# EAGLE design ATMega168-CAN (EAGLE 7.2.0)
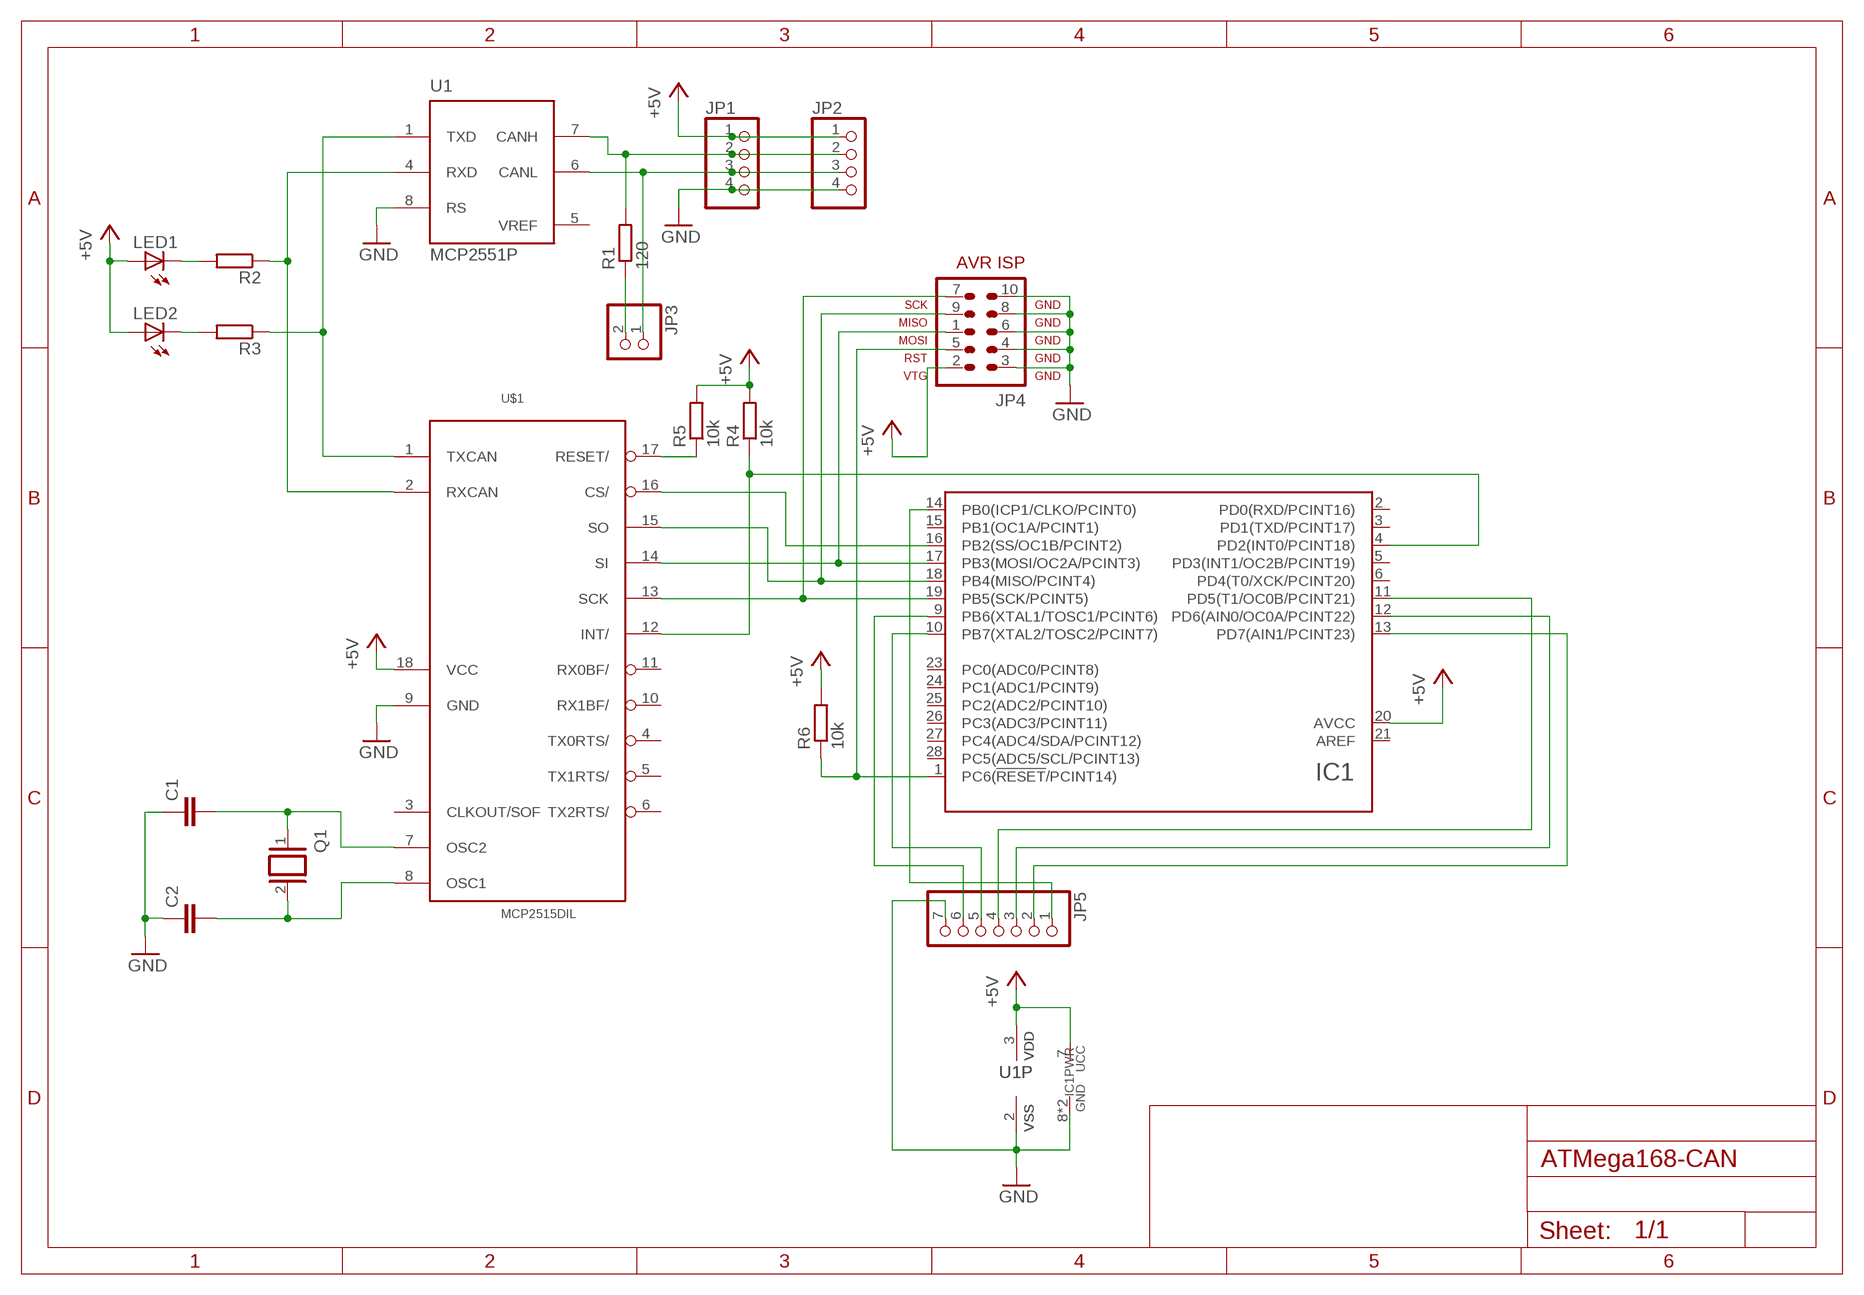
[diagram p0: schematic, sheet 1]

## Parts
C1  C-EU025-024X044  [C025-024X044]
C2  C-EU025-024X044  [C025-024X044]
IC1  ATMEGA48/88/168/328-PU(DIP28)PU  [DIL28]
JP1  PINHD-1X4/90  [1X04/90]
JP2  PINHD-1X4/90  [1X04/90]
JP3  PINHD-1X2  [1X02]
JP4  AVR-ISP-10  [AVR-ISP-10]
JP5  PINHD-1X7  [1X07]
LED1  LED5MM  [LED5MM]
LED2  LED5MM  [LED5MM]
Q1  XTAL/S  [QS]
R1  120  R-EU_0207/10  [0207/10]
R2  R-EU_0207/10  [0207/10]
R3  R-EU_0207/10  [0207/10]
R4  10k  R-EU_0207/10  [0207/10]
R5  10k  R-EU_0207/10  [0207/10]
R6  10k  R-EU_0207/10  [0207/10]
U1  MCP2551P  [DIL8]
U$1  MCP2515DIL  [DIL18]

## Nets
+5V: IC1.7(UCC) IC1.20(AVCC) JP1.1 JP2.1 JP4.2 LED1.A LED2.A R4.2 R5.2 R6.2 U1.3(VDD) U$1.18(VCC)
GND: C1.1 C2.1 IC1.8(GND) IC1.22(GND) JP1.4 JP2.4 JP4.3 JP4.4 JP4.6 JP4.8 JP4.10 JP5.7 U1.2(VSS) U1.8(RS) U$1.9(GND)
N$1: C2.2 Q1.2 U$1.8(OSC1)
N$2: C1.2 Q1.1 U$1.7(OSC2)
N$3: JP1.2 JP2.2 R1.2 U1.7(CANH)
N$4: JP1.3 JP2.3 JP3.1 U1.6(CANL)
N$5: IC1.4(PD2(INT0/PCINT18)) R4.1 U$1.12(INT/)
N$6: IC1.19(PB5(SCK/PCINT5)) JP4.7 U$1.13(SCK)
N$7: JP3.2 R1.1
N$8: IC1.17(PB3(MOSI/OC2A/PCINT3)) JP4.1 U$1.14(SI)
N$9: IC1.18(PB4(MISO/PCINT4)) JP4.9 U$1.15(SO)
N$10: IC1.16(PB2(SS/OC1B/PCINT2)) U$1.16(CS/)
N$11: R3.1 U1.1(TXD) U$1.1(TXCAN)
N$12: R2.1 U1.4(RXD) U$1.2(RXCAN)
N$13: LED1.K(C) R2.2
N$14: LED2.K(C) R3.2
N$15: R5.1 U$1.17(RESET/)
N$16: IC1.1(PC6(!RESET!/PCINT14)) JP4.5 R6.1
N$17: IC1.9(PB6(XTAL1/TOSC1/PCINT6)) JP5.6
N$18: IC1.10(PB7(XTAL2/TOSC2/PCINT7)) JP5.5
N$19: IC1.11(PD5(T1/OC0B/PCINT21)) JP5.4
N$20: IC1.12(PD6(AIN0/OC0A/PCINT22)) JP5.3
N$21: IC1.13(PD7(AIN1/PCINT23)) JP5.2
N$22: IC1.14(PB0(ICP1/CLKO/PCINT0)) JP5.1
Unconnected: IC1.2(PD0(RXD/PCINT16)) IC1.3(PD1(TXD/PCINT17)) IC1.5(PD3(INT1/OC2B/PCINT19)) IC1.6(PD4(T0/XCK/PCINT20)) IC1.15(PB1(OC1A/PCINT1)) IC1.21(AREF) IC1.23(PC0(ADC0/PCINT8)) IC1.24(PC1(ADC1/PCINT9)) IC1.25(PC2(ADC2/PCINT10)) IC1.26(PC3(ADC3/PCINT11)) IC1.27(PC4(ADC4/SDA/PCINT12)) IC1.28(PC5(ADC5/SCL/PCINT13)) U$1.3(CLKOUT/SOF) U$1.4(TX0RTS/) U$1.5(TX1RTS/) U$1.6(TX2RTS/) U$1.10(RX1BF/) U$1.11(RX0BF/)

## Power pins joined to a net without a drawn wire
VREF: U1.5(VREF)

## Library data of the parts
C1 C2 = rcl:C-EU: CAPACITOR, European symbol
IC1 = atmel_tiny24-44-84tiny48-88mega48-88-168-328:ATMEGA48/88/168/328-PU(DIP28)
JP1 JP2 = pinhead:PINHD-1X4: PIN HEADER
JP3 = pinhead:PINHD-1X2: PIN HEADER
JP4 = avr-7:AVR-ISP-10: AVR ISP-10 Serial Programming Header
JP5 = pinhead:PINHD-1X7: PIN HEADER
LED1 LED2 = led:LED: LED OSRAM: - CHIPLED LG R971, LG N971, LY N971, LG Q971, LY Q971, LO R971, LY R971 LH N974, LH R974 LS Q976, LO Q976, LY Q976 LO Q996 - Hyper CHIPLED LW Q18S LB Q993, LB Q99A, LB R99A - SideLED LS A670, LO A670, LY A670, LG A670, LP A670 LB A673, LV A673, LT A673, LW A673 LH A674 LY A675 LS A676, LA A676, LO A676, LY A676, LW A676 LS A679, LY A679, LG A679 - Hyper Micro SIDELED® LS Y876, LA Y876, LO Y876, LY Y876 LT Y87S - SmartLED LW L88C, LW L88S LB L89C, LB L89S, LG L890 LS L89K, LO L89K, LY L89K LS L896, LA L896, LO L896, LY L896 - TOPLED LS T670, LO T670, LY T670, LG T670, LP T670 LSG T670, LSP T670, LSY T670, LOP T670, LYG T670 LG T671, LOG T671, LSG T671 LB T673, LV T673, LT T673, LW T673 LH T674 LS T676, LA T676, LO T676, LY T676, LB T676, LH T676, LSB T676, LW T676 LB T67C, LV T67C, LT T67C, LS T67K, LO T67K, LY T67K, LW E67C LS E67B, LA E67B, LO E67B, LY E67B, LB E67C, LV E67C, LT E67C LW T67C LS T679, LY T679, LG T679 LS T770, LO T770, LY T770, LG T770, LP T770 LB T773, LV T773, LT T773, LW T773 LH T774 LS E675, LA E675, LY E675, LS T675 LS T776, LA T776, LO T776, LY T776, LB T776 LHGB T686 LT T68C, LB T68C - Hyper Mini TOPLED® LB M676 - Mini TOPLED Santana® LG M470 LS M47K, LO M47K, LY M47K Source: http://www.osram.convergy.de LUXEON: - LUMILED® LXK2-PW12-R00, LXK2-PW12-S00, LXK2-PW14-U00, LXK2-PW14-V00 LXK2-PM12-R00, LXK2-PM12-S00, LXK2-PM14-U00 LXK2-PE12-Q00, LXK2-PE12-R00, LXK2-PE12-S00, LXK2-PE14-T00, LXK2-PE14-U00 LXK2-PB12-K00, LXK2-PB12-L00, LXK2-PB12-M00, LXK2-PB14-N00, LXK2-PB14-P00, LXK2-PB14-Q00 LXK2-PR12-L00, LXK2-PR12-M00, LXK2-PR14-Q00, LXK2-PR14-R00 LXK2-PD12-Q00, LXK2-PD12-R00, LXK2-PD12-S00 LXK2-PH12-R00, LXK2-PH12-S00 LXK2-PL12-P00, LXK2-PL12-Q00, LXK2-PL12-R00 Source: www.luxeon.com KINGBRIGHT: KA-3528ASYC Source: www.kingbright.com
Q1 = special:XTAL/S: CRYSTAL
R1-R6 = rcl:R-EU_: RESISTOR, European symbol
U1 = microchip_can:MCP2551: High Speed CAN tranceiver
U$1 = MCP2515_MT:MCP2515*: MCP2515 Standalone CAN-Controller by Microchip Eagle-Lib. by MartinThomas

## Board
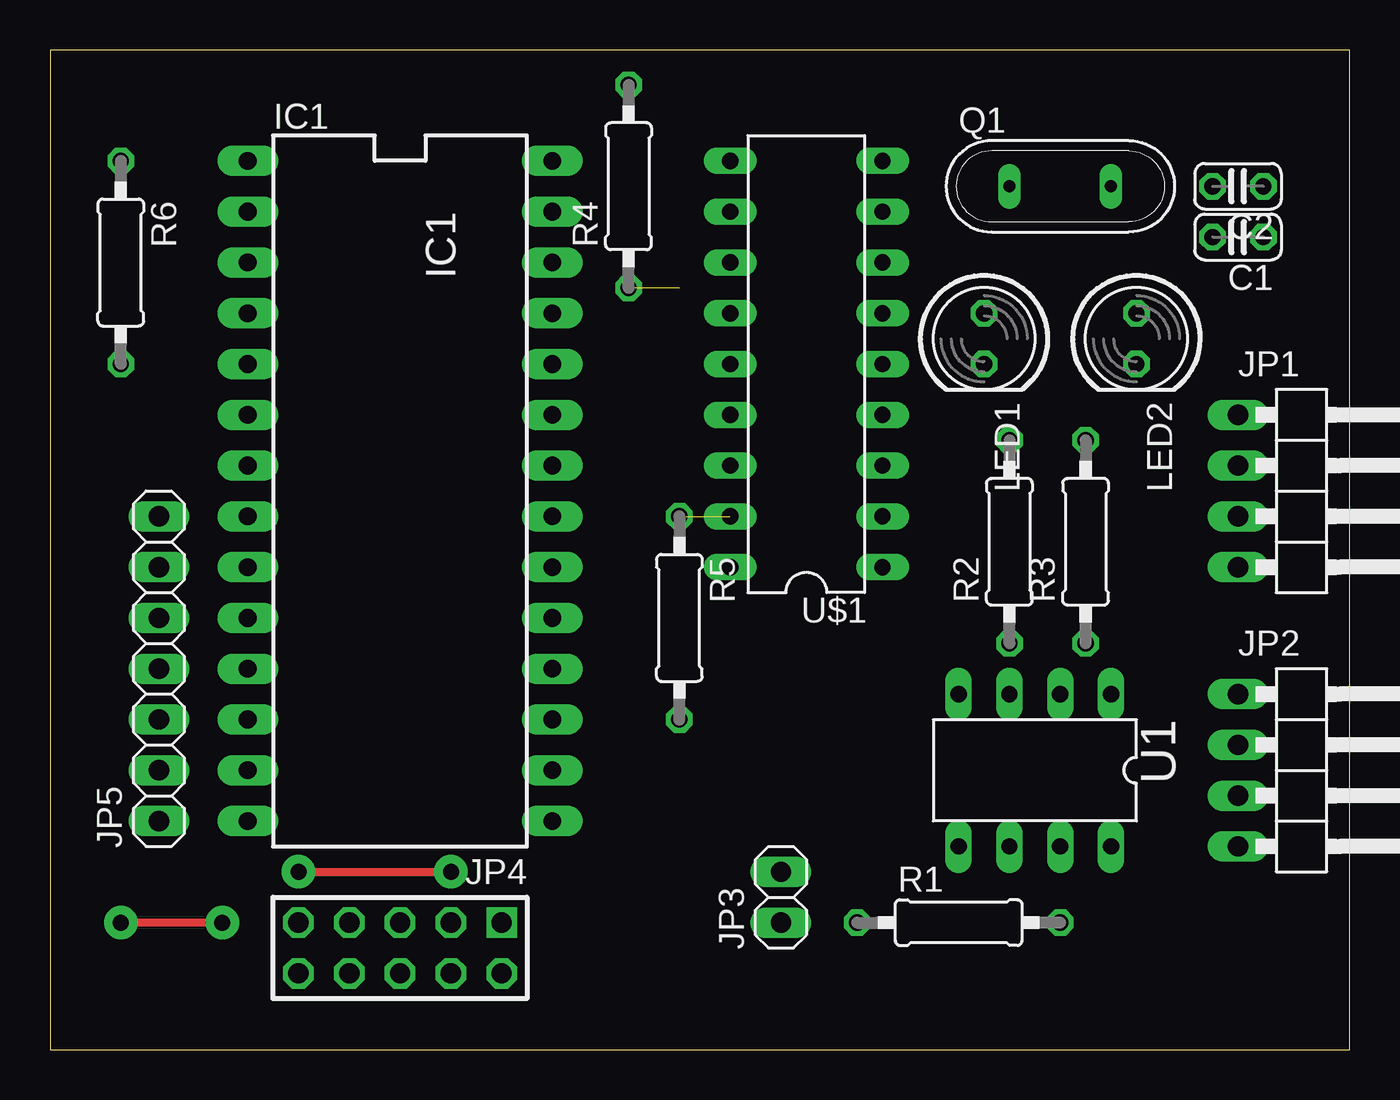
[diagram p1: board, top side]
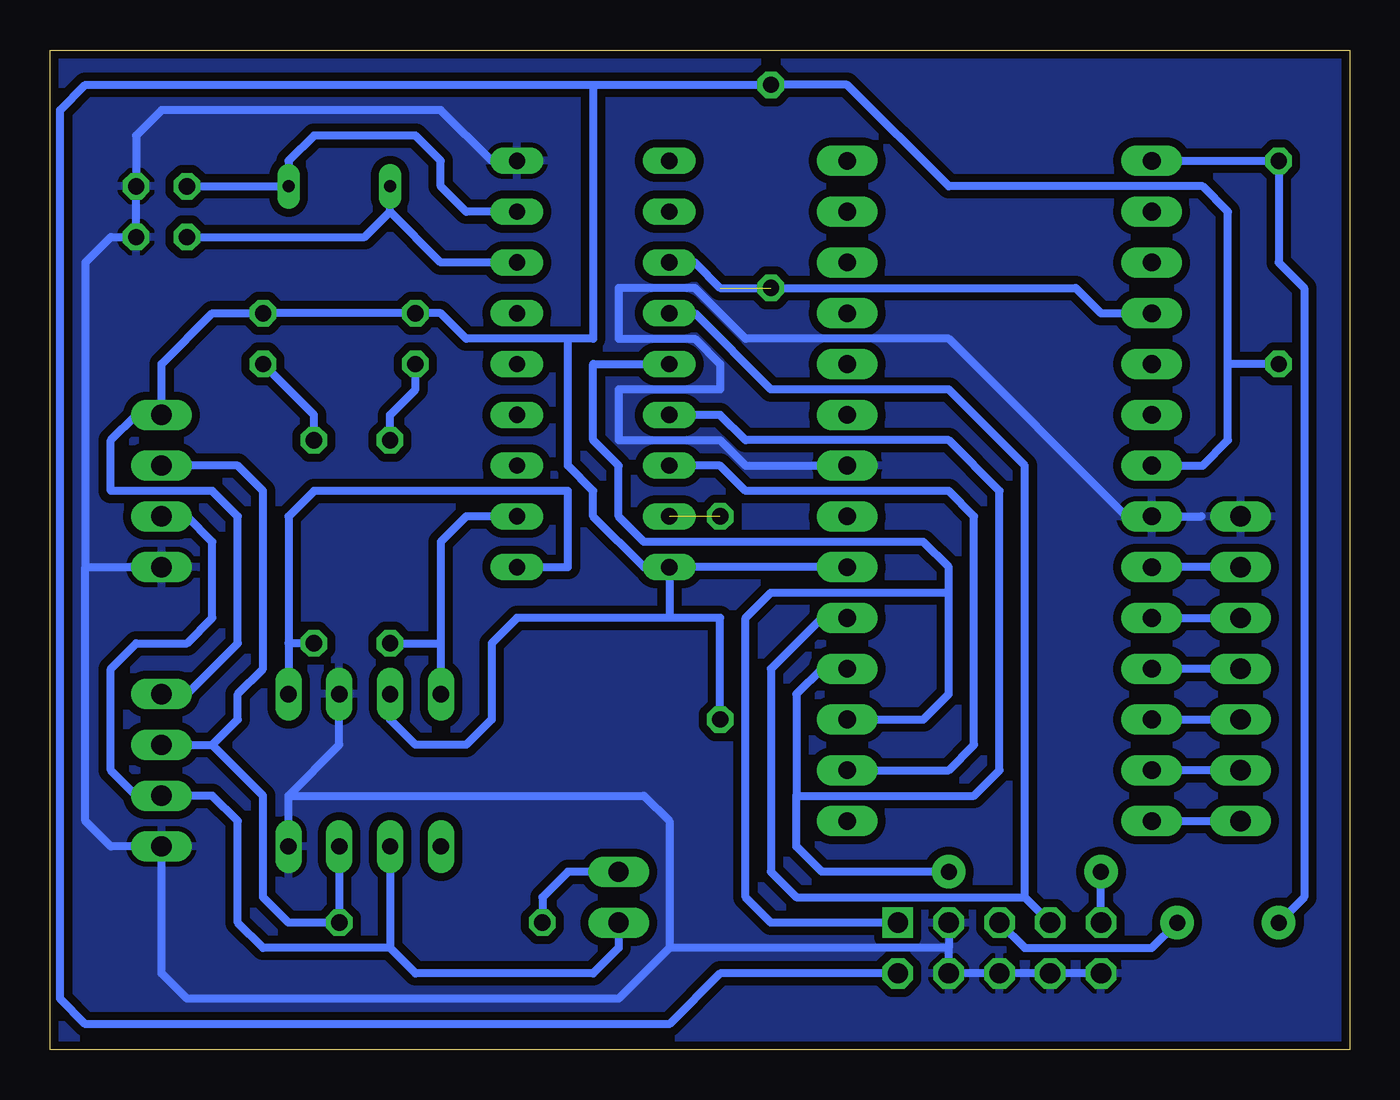
[diagram p2: board, bottom side, seen from below]

Size 65 x 50 mm. Coordinates in mm from the lower left corner, seen from the top.
Outline: 0,0 65,0 65,50 0,50 0,0
Copper layers (1*16): Top 0.035mm / dielectric 1.5mm / Bottom 0.035mm
Design rules "default *": minimum track width 10mil, minimum drill 24mil, track to track 16mil, track to pad 16mil, pad to pad 16mil, via to via 16mil, smd to smd 0mil, copper to edge 16mil, drill to drill 8mil, minimum pad ring 10mil, minimum via ring 8mil, stop-mask expansion 4mil, vias tented up to drill 0mil, thermal gap 10mil

### Footprints (pad centres in the part's own frame; a part is rotated, then mirrored left to right if it is on the bottom)
C025-024X044 = drill 0.813 octagon: 1 -1.27,0; 2 1.27,0
DIL28 = drill 0.889 pad 1.524 long: 1 -16.51,-7.62; 2 -13.97,-7.62; 3 -11.43,-7.62; 4 -8.89,-7.62; 5 -6.35,-7.62; 6 -3.81,-7.62; 7 -1.27,-7.62; 8 1.27,-7.62; 9 3.81,-7.62; 10 6.35,-7.62; 11 8.89,-7.62; 12 11.43,-7.62; 13 13.97,-7.62; 14 16.51,-7.62; 15 16.51,7.62; 16 13.97,7.62; 17 11.43,7.62; 18 8.89,7.62; 19 6.35,7.62; 20 3.81,7.62; 21 1.27,7.62; 22 -1.27,7.62; 23 -3.81,7.62; 24 -6.35,7.62; 25 -8.89,7.62; 26 -11.43,7.62; 27 -13.97,7.62; 28 -16.51,7.62
1X04/90 = drill 1.016 long: 1 -3.81,-3.81; 2 -1.27,-3.81; 3 1.27,-3.81; 4 3.81,-3.81
1X02 = drill 1.016 long: 1 -1.27,0; 2 1.27,0
AVR-ISP-10 = drill 1.016 square: 1 -5.08,-1.27 | drill 1.016 octagon: 2 -5.08,1.27; 3 -2.54,-1.27; 4 -2.54,1.27; 5 0,-1.27; 6 0,1.27; 7 2.54,-1.27; 8 2.54,1.27; 9 5.08,-1.27; 10 5.08,1.27
1X07 = drill 1.016 long: 1 -7.62,0; 2 -5.08,0; 3 -2.54,0; 4 0,0; 5 2.54,0; 6 5.08,0; 7 7.62,0
LED5MM = drill 0.813 octagon: A -1.27,0; K 1.27,0
QS = drill 0.61 long: 1 -2.54,0; 2 2.54,0
0207/10 = drill 0.813 octagon: 1 -5.08,0; 2 5.08,0
DIL8 = drill 0.813 long: 1 -3.81,-3.81; 2 -1.27,-3.81; 3 1.27,-3.81; 4 3.81,-3.81; 5 3.81,3.81; 6 1.27,3.81; 7 -1.27,3.81; 8 -3.81,3.81
DIL18 = drill 0.813 long: 1 -10.16,-3.81; 2 -7.62,-3.81; 3 -5.08,-3.81; 4 -2.54,-3.81; 5 0,-3.81; 6 2.54,-3.81; 7 5.08,-3.81; 8 7.62,-3.81; 9 10.16,-3.81; 10 10.16,3.81; 11 7.62,3.81; 12 5.08,3.81; 13 2.54,3.81; 14 0,3.81; 15 -2.54,3.81; 16 -5.08,3.81; 17 -7.62,3.81; 18 -10.16,3.81

### Placement (x,y rotation side)
C1  59.42,40.64 180 top
C2  59.42,43.18 180 top
IC1  17.51,27.94 270 top
JP1  63.23,27.94 270 top
JP2  63.23,13.97 270 top
JP3  36.56,7.62 90 top
JP4  17.51,5.08 180 top
JP5  5.45,19.05 90 top
LED1  46.72,35.56 270 top
LED2  54.34,35.56 270 top
Q1  50.53,43.18 0 top
R1  45.45,6.35 0 top
R2  47.99,25.4 90 top
R3  51.8,25.4 90 top
R4  28.94,43.18 90 top
R5  31.48,21.59 270 top
R6  3.54,39.37 270 top
U1  49.26,13.97 180 top
U$1  37.83,34.29 90 top

### Tracks (layer width: path | path; a pad name or v marks a point on that pad's centre or on a via)
+5V
  Bottom 0.406: JP2.1 58.15,17.78 55.61,20.32 55.61,26.67 56.88,27.94 61.96,27.94 61.96,30.48 60.69,31.75 JP1.1 59.42,34.29 56.88,36.83 LED2.A LED1.A 45.45,36.83 44.18,35.56 39.1,35.56 | U$1.18 35.29,24.13 37.83,26.67 37.83,27.94 39.1,29.21 39.1,35.56 | 39.1,35.56 37.83,35.56 37.83,48.26 | U$1.18 34.02,21.59 | 34.02,21.59 41.64,21.59 42.91,20.32 42.91,16.51 44.18,15.24 46.72,15.24 47.99,16.51 U1.3 | IC1.20 U$1.18 | JP4.2 31.48,3.81 34.02,1.27 63.23,1.27 64.5,2.54 64.5,46.99 63.23,48.26 37.83,48.26 | 37.83,48.26 R4.2 25.13,48.26 20.05,43.18 7.35,43.18 6.08,41.91 6.08,34.29 | R5.2 31.48,21.59 34.02,21.59 | IC1.7 7.35,29.21 6.08,30.48 6.08,34.29 | R6.2 6.08,34.29
GND
  Bottom 0.406: 53.07,12.7 50.53,15.24 U1.2 | 63.23,24.13 63.23,11.43 61.96,10.16 JP2.4 59.42,3.81 58.15,2.54 36.56,2.54 34.02,5.08 | 63.23,24.13 JP1.4 | 63.23,24.13 63.23,39.37 61.96,40.64 C1.1 C2.1 60.69,45.72 59.42,46.99 45.45,46.99 42.91,44.45 U$1.9 | JP4.10 JP4.8 JP4.6 JP4.4 20.05,5.08 | JP4.3 20.05,5.08 | 20.05,5.08 34.02,5.08 | U1.8 53.07,12.7 | 53.07,12.7 35.29,12.7 34.02,11.43 34.02,5.08 | IC1.22 30.21,29.21 31.48,30.48 36.56,30.48 36.56,33.02 31.48,33.02 31.48,34.29 32.75,35.56 36.56,35.56 36.56,38.1 32.75,38.1 30.21,35.56 20.05,35.56 11.16,26.67 IC1.8 7.4,26.67
  pour Bottom: 0,50 0,0 65,0 65,50
N$1
  Bottom 0.406: U$1.8 44.18,41.91 45.45,43.18 45.45,44.45 46.72,45.72 51.8,45.72 53.07,44.45 Q1.2 C2.2
N$2
  Bottom 0.406: U$1.7 45.45,39.37 47.99,41.91 | 47.99,41.91 Q1.1 | C1.2 49.26,40.64 47.99,41.91
N$3
  Bottom 0.406: U1.7 R1.2 53.07,6.35 54.34,7.62 54.34,12.7 56.88,15.24 | JP2.2 56.88,15.24 | 56.88,15.24 55.61,16.51 55.61,17.78 54.34,19.05 54.34,27.94 55.61,29.21 JP1.2
N$4
  Bottom 0.406: JP1.3 58.15,26.67 56.88,25.4 56.88,21.59 58.15,20.32 60.69,20.32 61.96,19.05 61.96,13.97 60.69,12.7 JP2.3 56.88,12.7 55.61,11.43 55.61,6.35 54.34,5.08 47.99,5.08 | U1.6 47.99,5.08 | JP3.1 36.56,5.08 37.83,3.81 46.72,3.81 47.99,5.08
N$5  (1 unrouted)
  Bottom 0.406: U$1.12 32.75,39.37 31.48,38.1 13.7,38.1 12.43,36.83 IC1.4
N$6
  Bottom 0.406: IC1.19 26.4,21.59 28.94,19.05 28.94,8.89 27.67,7.62 16.24,7.62 | 16.24,7.62 16.24,29.21 20.05,33.02 28.94,33.02 32.75,36.83 U$1.13 | JP4.7 16.24,7.62
N$7
  Bottom 0.406: JP3.2 39.1,8.89 40.37,7.62 R1.1
N$8
  Bottom 0.406: IC1.17 21.32,16.51 20.05,17.78 20.05,22.86 | 20.05,22.86 20.05,24.13 21.32,25.4 35.29,25.4 36.56,26.67 36.56,29.21 37.83,30.48 37.83,34.29 U$1.14 | 20.05,22.86 28.94,22.86 30.21,21.59 30.21,7.62 28.94,6.35 JP4.1
N$9  (via drill 0.8 pad 1.68)
  Top 0.406: v12.43,8.89 v20.05,8.89
  Bottom 0.406: IC1.18 26.4,19.05 27.67,17.78 27.67,12.7 | 27.67,12.7 18.78,12.7 17.51,13.97 17.51,27.94 20.05,30.48 30.21,30.48 31.48,31.75 U$1.15 | JP4.9 v12.43,8.89 | v20.05,8.89 26.4,8.89 27.67,10.16 27.67,12.7
N$10
  Bottom 0.406: IC1.16 20.05,13.97 18.78,15.24 18.78,26.67 20.05,27.94 30.21,27.94 31.48,29.21 U$1.16
N$11
  Bottom 0.406: U$1.1 39.1,24.13 39.1,27.94 51.8,27.94 53.07,26.67 53.07,20.32 | 53.07,20.32 U1.1 | R3.1 53.07,20.32
N$12
  Bottom 0.406: U$1.2 44.18,26.67 45.45,25.4 45.45,20.32 | 45.45,20.32 U1.4 | R2.1 45.45,20.32
N$13
  Bottom 0.406: R2.2 47.99,31.75 46.72,33.02 LED1.K
N$14
  Bottom 0.406: R3.2 51.8,31.75 LED2.K
N$15  (1 unrouted)
N$16  (via drill 0.8 pad 1.68)
  Top 0.406: v8.62,6.35 v3.54,6.35
  Bottom 0.406: JP4.5 16.24,5.08 9.89,5.08 v8.62,6.35 | IC1.1 R6.1 3.54,39.37 2.27,38.1 2.27,7.62 v3.54,6.35
N$17
  Bottom 0.406: JP5.6 IC1.9
N$18
  Bottom 0.406: IC1.10 JP5.5
N$19
  Bottom 0.406: JP5.4 IC1.11
N$20
  Bottom 0.406: IC1.12 JP5.3
N$21
  Bottom 0.406: JP5.2 IC1.13
N$22
  Bottom 0.406: IC1.14 JP5.1
N$23
  pour Bottom: 0,0 0,50 65,50 65,0